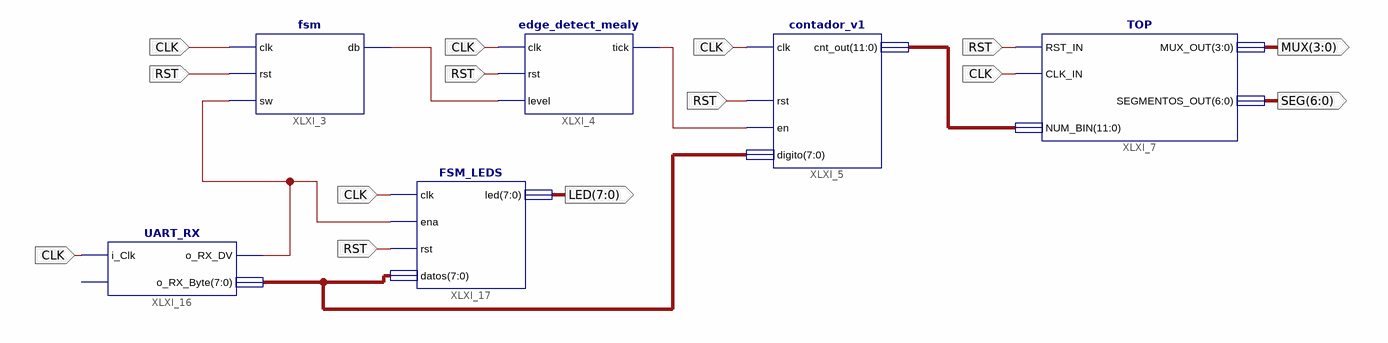
[diagram p0: schematic sheet 1]
// Xilinx ISE schematic TOP_GENERAL.sch (spartan3e) as structural Verilog: 6 symbols, 5 ports
module TOP_GENERAL (
  input  RST,
  input  CLK,
  output [3:0] MUX,
  output [6:0] SEG,
  output [7:0] LED
);

  wire XLXN_36, XLXN_43, XLXN_83;
  wire [7:0] XLXN_86;
  wire [11:0] XLXN_38;

  fsm XLXI_3 (.clk(CLK), .rst(RST), .sw(XLXN_83), .db(XLXN_36));
  edge_detect_mealy XLXI_4 (.clk(CLK), .rst(RST), .level(XLXN_36), .tick(XLXN_43));
  contador_v1 XLXI_5 (.clk(CLK), .rst(RST), .en(XLXN_43), .cnt_out(XLXN_38), .digito(XLXN_86));
  TOP XLXI_7 (.CLK_IN(CLK), .NUM_BIN(XLXN_38), .RST_IN(RST), .MUX_OUT(MUX), .SEGMENTOS_OUT(SEG));
  FSM_LEDS XLXI_17 (.clk(CLK), .ena(XLXN_83), .rst(RST), .datos(XLXN_86), .led(LED));
  UART_RX XLXI_16 (.i_Clk(CLK), .o_RX_DV(XLXN_83), .o_RX_Byte(XLXN_86));  // open: i_RX_Serial
endmodule
